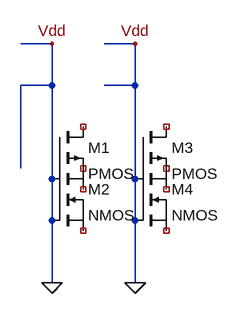
[diagram p0: schematic final_24HP.asc]
final_24HP.asc, the LTspice schematic file:
Version 4.1
SHEET 1 880 680
WIRE 32 32 -16 32
WIRE 160 32 112 32
WIRE 32 96 32 32
WIRE 32 96 -16 96
WIRE 160 96 160 32
WIRE 160 96 112 96
WIRE -16 224 -16 96
WIRE 32 240 32 96
WIRE 160 240 160 96
WIRE 32 304 32 240
WIRE 160 304 160 240
WIRE 32 400 32 304
WIRE 160 400 160 304
FLAG 32 400 0
FLAG 160 400 0
FLAG 32 32 Vdd
FLAG 160 32 Vdd
SYMBOL nmos 32 224 R0
SYMATTR InstName M2
SYMBOL pmos 32 160 R0
SYMATTR InstName M1
SYMBOL nmos 160 224 R0
SYMATTR InstName M4
SYMBOL pmos 160 160 R0
SYMATTR InstName M3

The netlist it stands for:
* final_24HP.asc
M2 NC_01 0 NC_02 NC_02 NMOS
M1 NC_03 0 NC_04 NC_04 PMOS
M4 NC_05 0 NC_06 NC_06 NMOS
M3 NC_07 0 NC_08 NC_08 PMOS
.model NMOS NMOS
.model PMOS PMOS
.lib standard.mos
.backanno
.end